# EAGLE schematic fio_v1.0 (EAGLE 5.00)
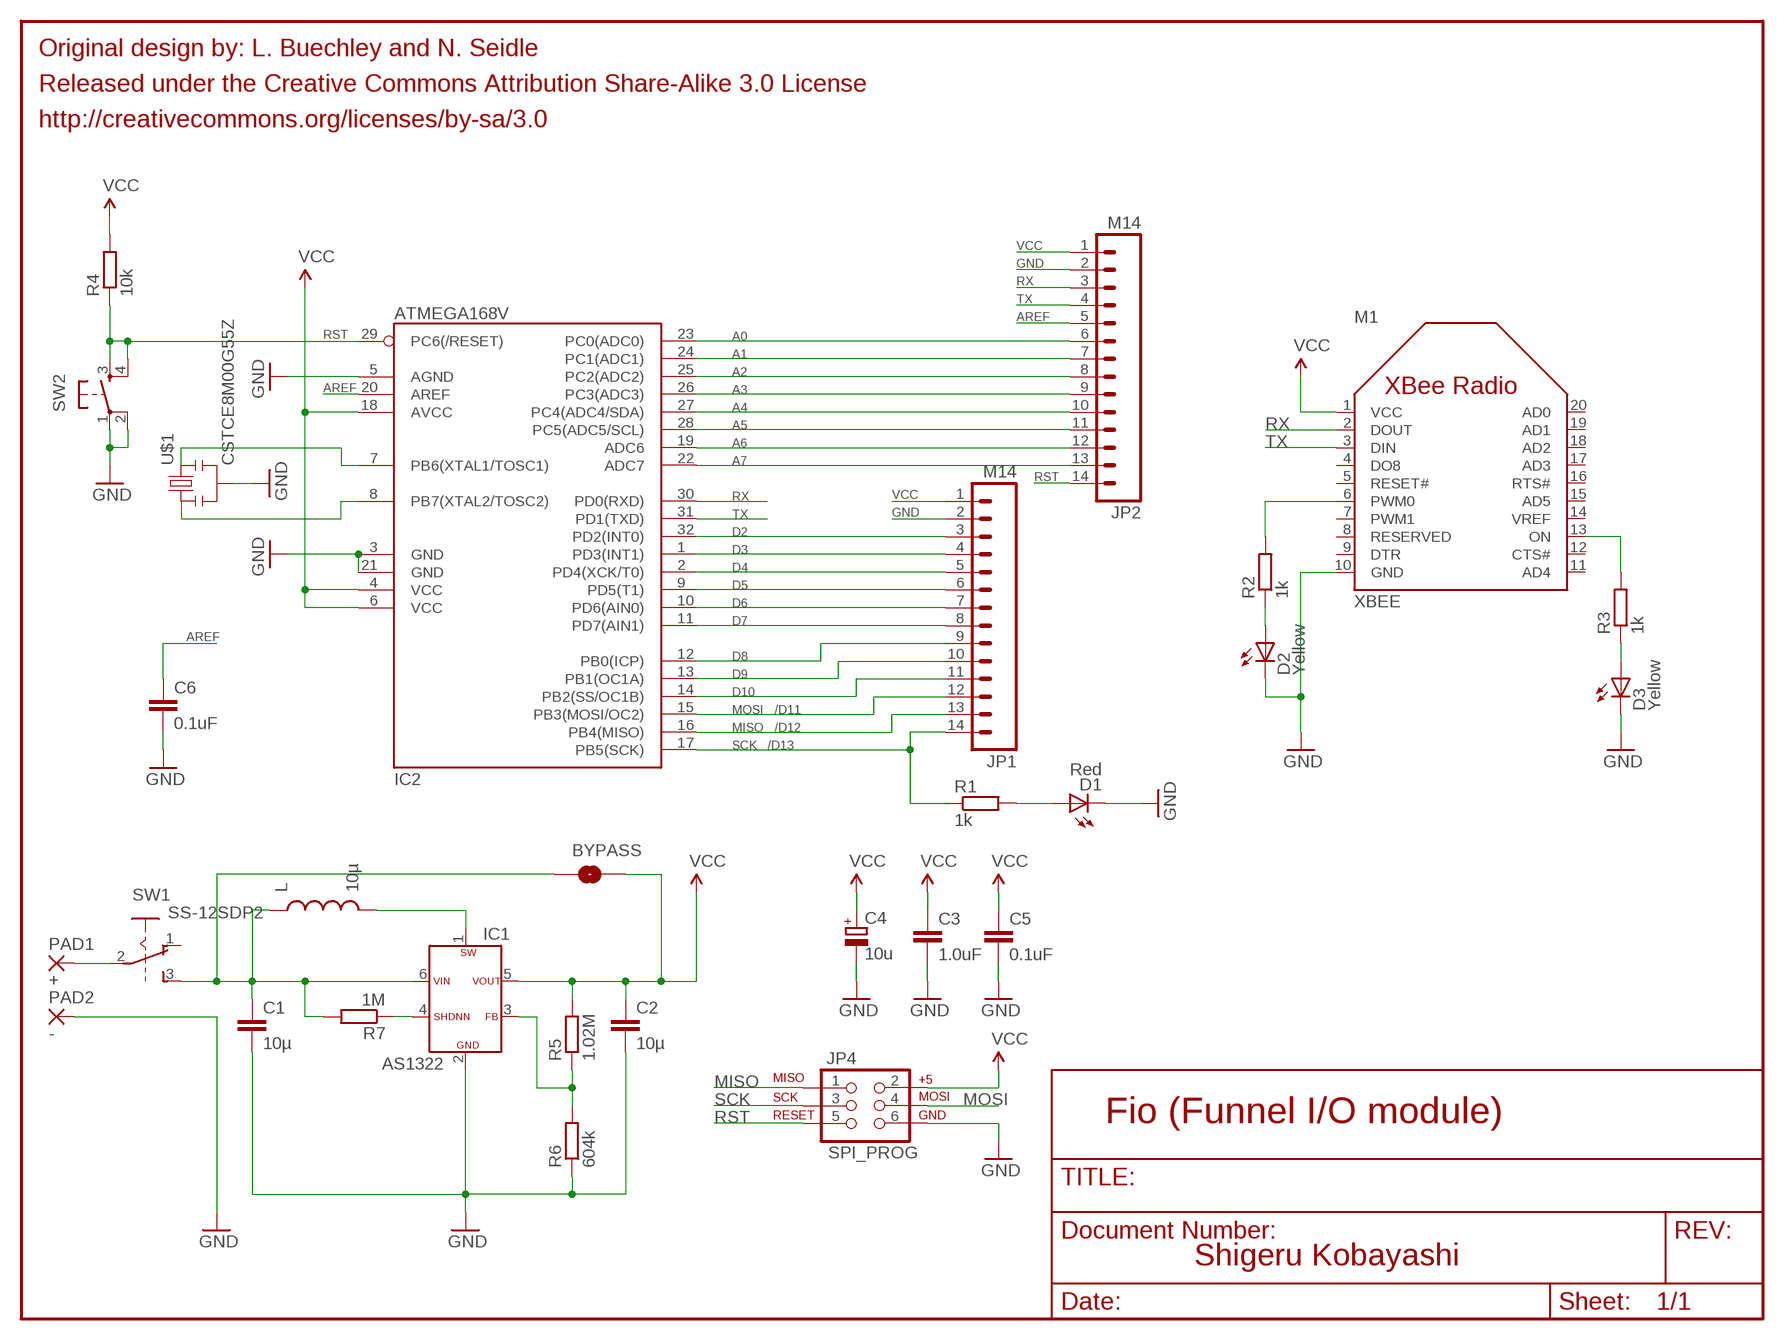
[diagram p0: schematic, sheet 1]

## Parts
BYPASS  SOLDERJUMPERNO  [SJ-NO]
C1  10µ  C-EUC0805K  [C0805K]
C2  10µ  C-EUC0805K  [C0805K]
C3  1.0uF  CAP0603  [0603]
C4  10u  CPOL-EUB  [PANASONIC_B]
C5  0.1uF  CAP0603  [0603]
C6  0.1uF  CAP0603  [0603]
D1  Red  LEDCHIPLED_0805  [CHIPLED_0805]
D2  Yellow  LEDCHIPLED_0805  [CHIPLED_0805]
D3  Yellow  LEDCHIPLED_0805  [CHIPLED_0805]
IC1  AS1322  [SOT23-6]
IC2  ATMEGA168V  ATMEGA168  [TQFP32-08]
JP1  M14  [1X14]
JP2  M14  [1X14]
JP4  SPI_PROG  AVR_SPI_PRG_6NS  [2X3-NS]
L  10µ  A921CY  [D63LCB]
M1  XBEE  [XBEE]
PAD1  +  2,54/1,0  [2,54/1,0]
PAD2  -  2,54/1,0  [2,54/1,0]
R1  1k  R-EU_R0603  [R0603]
R2  1k  R-EU_R0603  [R0603]
R3  1k  R-EU_R0603  [R0603]
R4  10k  R-EU_R0603  [R0603]
R5  1.02M  R-EU_R0603  [R0603]
R6  604k  R-EU_R0603  [R0603]
R7  1M  R-EU_R0603  [R0603]
SW1  SS-12SDP2  [SS-12SDP2]
SW2  OMRON_B3SN-3012  [B3SN-3012]
U$1  CSTCE8M00G55Z  RESONATORSMD  [RESONATOR-SMD]

## Nets
A0: IC2.23(PC0(ADC0)) JP2.6
A1: IC2.24(PC1(ADC1)) JP2.7
A2: IC2.25(PC2(ADC2)) JP2.8
A3: IC2.26(PC3(ADC3)) JP2.9
A4: IC2.27(PC4(ADC4/SDA)) JP2.10
A5: IC2.28(PC5(ADC5/SCL)) JP2.11
A6: IC2.19(ADC6) JP2.12
A7: IC2.22(ADC7) JP2.13
AREF: C6.1 IC2.20(AREF) JP2.5
D2: IC2.32(PD2(INT0)) JP1.3
D3: IC2.1(PD3(INT1)) JP1.4
D4: IC2.2(PD4(XCK/T0)) JP1.5
D5: IC2.9(PD5(T1)) JP1.6
D6: IC2.10(PD6(AIN0)) JP1.7
D7: IC2.11(PD7(AIN1)) JP1.8
D8: IC2.12(PB0(ICP)) JP1.9
D9: IC2.13(PB1(OC1A)) JP1.10
D10: IC2.14(PB2(SS/OC1B)) JP1.11
GND: C1.2 C2.2 C3.2 C4.- C5.2 C6.2 D1.C D2.C D3.C IC1.2(GND) IC2.3(GND) IC2.5(AGND) IC2.21(GND) JP1.2 JP2.2 JP4.6 M1.10(GND) PAD2.1(P) R6.1 SW2.1 SW2.2 U$1.2
MISO: IC2.16(PB4(MISO)) JP1.13 JP4.1
MOSI: IC2.15(PB3(MOSI/OC2)) JP1.12 JP4.4
N$1: M1.13(ON) R3.2
N$2: D1.A R1.2
N$3: D2.A R2.1
N$4: M1.6(PWM0) R2.2
N$5: PAD1.1(P) SW1.2(P)
N$6: D3.A R3.1
N$10: IC2.7(PB6(XTAL1/TOSC1)) U$1.3
N$11: IC1.3(FB) R5.1 R6.2
N$12: IC2.8(PB7(XTAL2/TOSC2)) U$1.1
N$13: BYPASS.1 C1.1 IC1.6(VIN) L.P$1 R7.2 SW1.3(S)
N$14: IC1.1(SW) L.P$2
N$15: IC1.4(SHDNN) R7.1
RST: IC2.29(PC6(/RESET)) JP2.14 JP4.5 R4.1 SW2.3 SW2.4
RX: IC2.30(PD0(RXD)) JP2.3 M1.2(DOUT)
SCK: IC2.17(PB5(SCK)) JP1.14 JP4.3 R1.1
TX: IC2.31(PD1(TXD)) JP2.4 M1.3(DIN)
VCC [VCC]: BYPASS.2 C2.1 C3.1 C4.+ C5.1 IC1.5(VOUT) IC2.4(VCC) IC2.6(VCC) IC2.18(AVCC) JP1.1 JP2.1 JP4.2 M1.1(VCC) R4.2 R5.2
Unconnected: M1.4(DO8) M1.5(RESET#) M1.7(PWM1) M1.8(RESERVED) M1.9(DTR) M1.11(AD4) M1.12(CTS#) M1.14(VREF) M1.15(AD5) M1.16(RTS#) M1.17(AD3) M1.18(AD2) M1.19(AD1) M1.20(AD0) SW1.1(O)

## Notes on the sheet
- Original design by: L. Buechley and N. Seidle
- Released under the Creative Commons Attribution Share-Alike 3.0 License
- http://creativecommons.org/licenses/by-sa/3.0
- /D11
- /D12
- /D13
- Fio (Funnel I/O module)
- Shigeru Kobayashi

## Library data of the parts
BYPASS = SparkFun:SOLDERJUMPER: Solder Jumper Standard SMD solder jumper. Used to automate production. Two varients : Normally Open and Normally Closed are the same, but have different paste layers. NC will have a large amount of paste and should jumper during reflow.
C1 C2 = rcl:C-EU: CAPACITOR, European symbol
C3 C5 C6 = SparkFun:CAP: Capacitor Standard 0603 ceramic capacitor, and 0.1" leaded capacitor.
C4 = rcl:CPOL-EU: POLARIZED CAPACITOR, European symbol
D1-D3 = led:LED: LED OSRAM: - CHIPLED LG R971, LG N971, LY N971, LG Q971, LY Q971, LO R971, LY R971 LH N974, LH R974 LS Q976, LO Q976, LY Q976 LO Q996 - Hyper CHIPLED LW Q18S LB Q993, LB Q99A, LB R99A - SideLED LS A670, LO A670, LY A670, LG A670, LP A670 LB A673, LV A673, LT A673, LW A673 LH A674 LY A675 LS A676, LA A676, LO A676, LY A676, LW A676 LS A679, LY A679, LG A679 - Hyper Micro SIDELED® LS Y876, LA Y876, LO Y876, LY Y876 LT Y87S - SmartLED LW L88C, LW L88S LB L89C, LB L89S, LG L890 LS L89K, LO L89K, LY L89K LS L896, LA L896, LO L896, LY L896 - TOPLED LS T670, LO T670, LY T670, LG T670, LP T670 LSG T670, LSP T670, LSY T670, LOP T670, LYG T670 LG T671, LOG T671, LSG T671 LB T673, LV T673, LT T673, LW T673 LH T674 LS T676, LA T676, LO T676, LY T676, LB T676, LH T676, LSB T676, LW T676 LB T67C, LV T67C, LT T67C, LS T67K, LO T67K, LY T67K, LW E67C LS E67B, LA E67B, LO E67B, LY E67B, LB E67C, LV E67C, LT E67C LW T67C LS T679, LY T679, LG T679 LS T770, LO T770, LY T770, LG T770, LP T770 LB T773, LV T773, LT T773, LW T773 LH T774 LS E675, LA E675, LY E675, LS T675 LS T776, LA T776, LO T776, LY T776, LB T776 LHGB T686 LT T68C, LB T68C - Hyper Mini TOPLED® LB M676 - Mini TOPLED Santana® LG M470 LS M47K, LO M47K, LY M47K Source: http://www.osram.convergy.de - LUMILED® LXK2-PW12-R00, LXK2-PW12-S00, LXK2-PW14-U00, LXK2-PW14-V00 LXK2-PM12-R00, LXK2-PM12-S00, LXK2-PM14-U00 LXK2-PE12-Q00, LXK2-PE12-R00, LXK2-PE12-S00, LXK2-PE14-T00, LXK2-PE14-U00 LXK2-PB12-K00, LXK2-PB12-L00, LXK2-PB12-M00, LXK2-PB14-N00, LXK2-PB14-P00, LXK2-PB14-Q00 LXK2-PR12-L00, LXK2-PR12-M00, LXK2-PR14-Q00, LXK2-PR14-R00 LXK2-PD12-Q00, LXK2-PD12-R00, LXK2-PD12-S00 LXK2-PH12-R00, LXK2-PH12-S00 LXK2-PL12-P00, LXK2-PL12-Q00, LXK2-PL12-R00 Source: www.luxeon.com
IC1 = austriamicrosystems_as1322:AS1322
IC2 = SparkFun:ATMEGA168
JP1 JP2 = SparkFun:M14: Header 14 Standard 14-pin 0.1" header. Use with straight break away headers (SKU : PRT-00116), right angle break away headers (PRT-00553), swiss pins (PRT-00743), machine pins (PRT-00117), and female headers (PRT-00115).
JP4 = SparkFun:AVR_SPI_PRG_6
L = inductor_toko:A921CY
M1 = digi_xbee:XBEE
PAD1 PAD2 = wirepad:2,54/1,0: THROUGH-HOLE PAD
R1-R7 = rcl:R-EU_: RESISTOR, European symbol
SW1 = nikkai_ss:SS-12S
SW2 = omron_b3sn:OMRON_: Momentary Switch Button commonly used for reset or general input. Spark Fun Electronics SKU : COM-00097
U$1 = SparkFun:RESONATOR: Resonator Small SMD resonator. This is the itty bitty 10/20MHz resonators with built in caps. CSTCE10M0G55 and CSTCE20M0V53. Footprint has been reviewed closely but hasn't been tested yet.

## Net classes
0 Default: width 0.203 mm
1 VCC: width 0.381 mm
2 LEDPower: width 0.203 mm
3 ButtonSignal: width 0.203 mm